# Altium schematic sheet Serial.SchDoc
size A; SheetNumber: 3; SheetTotal: 6
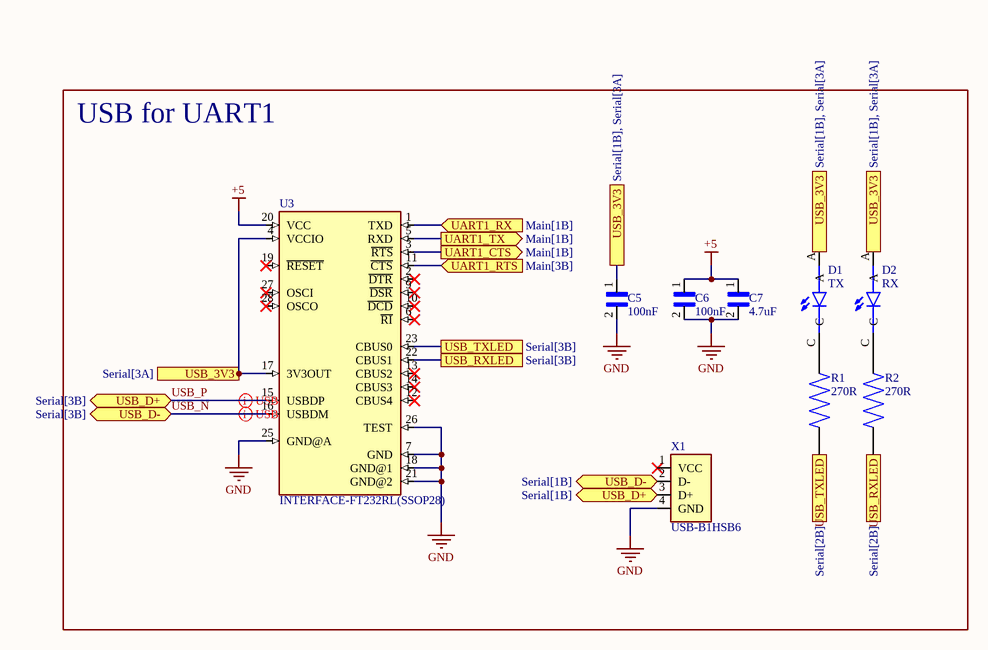
[diagram p0: Serial.SchDoc]

## Parts
C5  100nF  [CAPC2012X140N]
C6  100nF  [CAPC2012X140N]
C7  4.7uF  [CAPC2012X140N]
D1  TX  [LEDC3216X110]
D2  RX  [LEDC3216X110]
R1  270R  [RESC2012X55N]
R2  270R  [RESC2012X55N]
U3  INTERFACE-FT232RL(SSOP28)  [SSOP28-0.65-10.2X5.2MM]
X1  USB-B1HSB6  [OST_USB-B1HSB6]

## Blocks framed on the sheet
USB for UART1: C5-C7 D1 D2 R1 R2 U3 X1

## Ports
UART1_CTS (out, see Main[1B]), UART1_RTS (in, see Main[3B]), UART1_RX (in, see Main[1B]), UART1_TX (out, see Main[1B]), USB_3V3 (see Serial[1B], Serial[3A]), USB_3V3 (see Serial[3A]), USB_D+ (bidir, see Serial[1B]), USB_D+ (bidir, see Serial[3B]), USB_D- (bidir, see Serial[1B]), USB_D- (bidir, see Serial[3B]), USB_RXLED (see Serial[2B]), USB_RXLED (see Serial[3B]), USB_TXLED (see Serial[2B]), USB_TXLED (see Serial[3B])

## Nets
+5: C6.1 C7.1 U3.20(VCC)
GND: C5.2 C6.2 C7.2 U3.7(GND) U3.18(GND@1) U3.21(GND@2) U3.25(GND@A) U3.26(TEST) X1.4(GND)
UART1_CTS: U3.3(~{RTS}) ; port UART1_CTS
UART1_RTS: U3.11(~{CTS}) ; port UART1_RTS
UART1_RX: U3.1(TXD) ; port UART1_RX
UART1_TX: U3.5(RXD) ; port UART1_TX
USB_3V3: C5.1 D1.A D2.A U3.4(VCCIO) U3.17(3V3OUT) ; port USB_3V3
USB_N: U3.16(USBDM) X1.2(D-) ; port USB_D-
USB_P: U3.15(USBDP) X1.3(D+) ; port USB_D+
USB_RXLED: R2.1 U3.22(CBUS1) ; port USB_RXLED
USB_TXLED: R1.1 U3.23(CBUS0) ; port USB_TXLED
NetD1_C: D1.C R1.2
NetD2_C: D2.C R2.2

Not connected (* = marked no-connect by the designer): U3 2(~{DTR})* 6(~{RI})* 9(~{DSR})* 10(~{DCD})* 12(CBUS4)* 13(CBUS2)* 14(CBUS3)* 19(~{RESET})* 27(OSCI)* 28(OSCO)*; X1 1(VCC)*

## Layout directives
differential pair: USB_N, USB_P

## Library data of the parts
C5 C6 = 08055G104ZAT1A: CAPACITOR, 0805, 100NF, 50V; Capacitor Application:General Purpose; Dielectric Characteristic:Y5V; Capacitance:0.1ÂµF; Capacitance Tolerance:-20% to +80%; Voltage Rating:50V; Capacitor Case Style:0805; Capacitor Mounting:SMD; Operating Temperature Range:-25Â°C to +85Â°C; SVHC:No SVHC (15-Dec-2010); External Depth:0.95mm; External Length / Height:2mm; External Width:1.25mm; Insulation Resistance:10000Mohm; No. of Pins:2; Operating Temperature Max:85Â°C; Operating Temperature Min:-25Â°C; Package / Case:0805; Reel Quantity:3000; Tape Width:8mm; Temperature Coefficient:+22%, -82%; Terminal Type:Surface Mount (SMD, SMT); Termination Type:SMD; Tolerance +:80%; Tolerance -:20%; Voltage Rating VDC:50V; MF: {'manufacturer': u'AVX'}; Package: None; Availability: Unavailable; Value: *; MP: 08055G104ZAT1A; Price: None
C7 = CL21A475KOCLRNC: 0805 X5R 4.7UF 10% 16V; MF: {'manufacturer': u'Samsung'}; Value: *; Availability: Unavailable; Price: None; Package: None; MP: CL21A475KOCLRNC
D1 D2 = LTST-C230KRKT: LED SMT RED CLR 1206 TAPE; MF: {'manufacturer': u'Lite-On Electronics'}; Package: None; MP: LTST-C230KRKT; Value: *; Availability: Unavailable; Price: None
R1 R2 = TNPW0805270RBETA: MF: {'manufacturer': u'Vishay'}; MP: TNPW0805270RBETA; Availability: Unavailable; Package: None; Value: *; Price: None
U3 = INTERFACE-FT232RL(SSOP28): 310070022; MF: {'manufacturer': u'FTDI, Future'}; Price: None; Value: *; MP: FT232RL; Availability: Unavailable; Package: None
X1 = USB-B1HSB6: Conn Usb Type b r/a Black; MF: {'manufacturer': u'On Shore'}; MP: USB-B1HSB6; Availability: Unavailable; Package: None; Value: *; Price: None